# Altium schematic sheet H_BRIDGE.SchDoc
size A
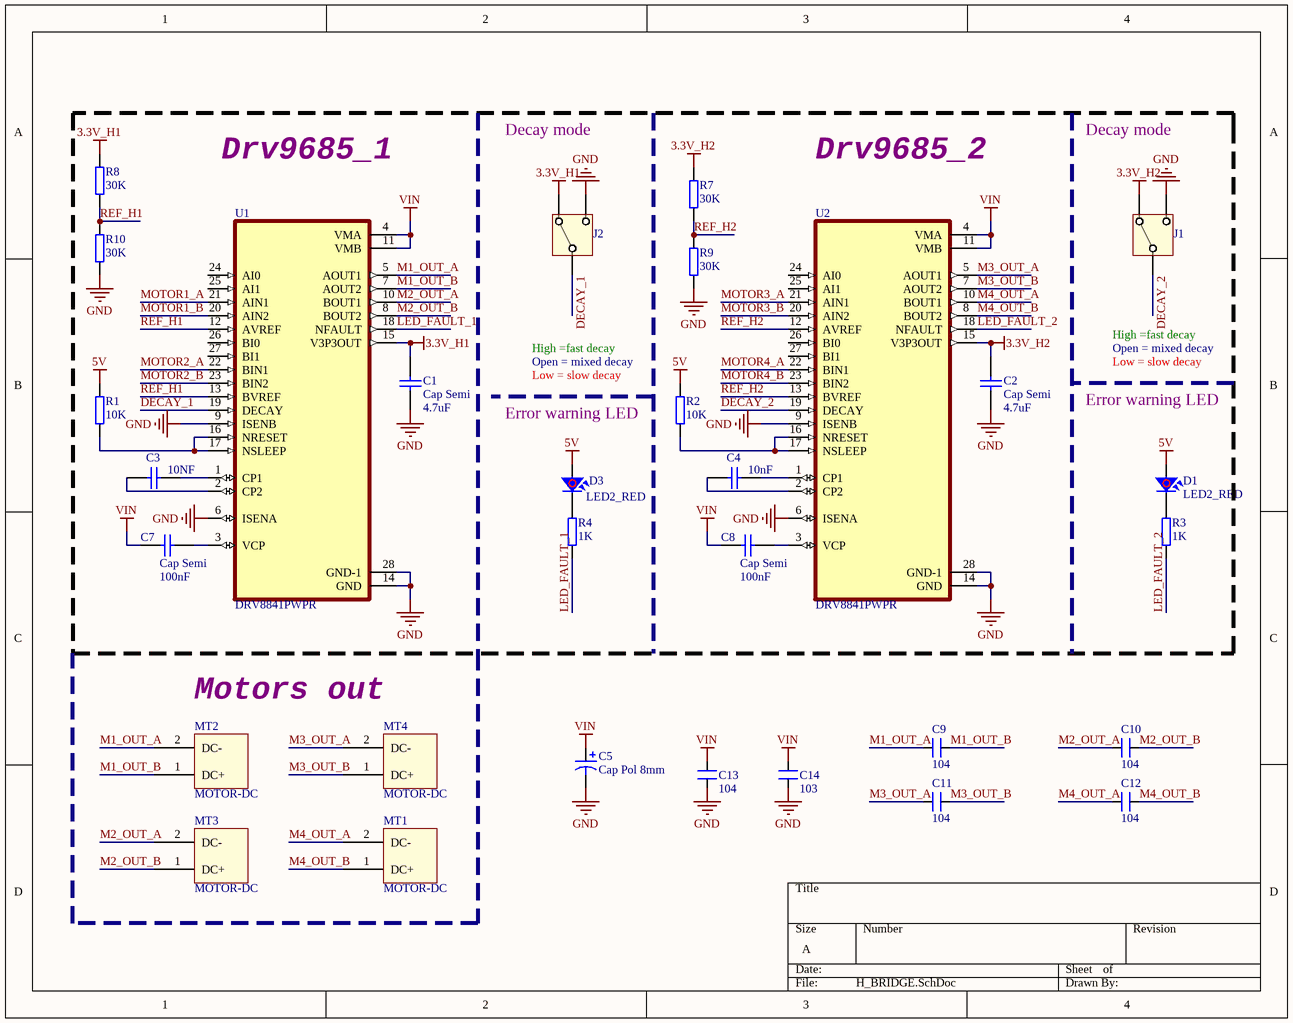
[diagram p0: H_BRIDGE.SchDoc]

## Parts
C1  Cap Semi  value 4.7uF  [SMT0603]
C2  Cap Semi  value 4.7uF  [SMT0603]
C3  value 10NF  [SMT0603]  (hidden comment: Cap Semi)
C4  value 10nF  [SMT0603]  (hidden comment: Cap Semi)
C5  Cap Pol 8mm  [C10mm]
C7  Cap Semi  value 100nF  [SMT0603]
C8  Cap Semi  value 100nF  [SMT0603]
C9  104  [SM-0805]
C10  104  [SM-0805]
C11  104  [SM-0805]
C12  104  [SM-0805]
C13  104  [SM-0805]
C14  103  [SM-0805]
D1  LED2_RED  [LED_RED_SMD0603]
D3  LED2_RED  [LED_RED_SMD0603]
J1  JUMPER-SOLDER-3WAY-BOTTOM  [JUMPER-SOLDER-3WAY-BOTTOM]  (value not drawn)
J2  JUMPER-SOLDER-3WAY-BOTTOM  [JUMPER-SOLDER-3WAY-BOTTOM]  (value not drawn)
MT1  MOTOR-DC  [CON2-5.08DC]
MT2  MOTOR-DC  [CON2-5.08DC]
MT3  MOTOR-DC  [CON2-5.08DC]
MT4  MOTOR-DC  [CON2-5.08DC]
R1  value 10K  [SMT0603]  (hidden comment: Resistor)
R2  value 10K  [SMT0603]  (hidden comment: Resistor)
R3  value 1K  [SMT0603]  (hidden comment: Resistor)
R4  value 1K  [SMT0603]  (hidden comment: Resistor)
R7  value 30K  [SMT0603]  (hidden comment: Resistor)
R8  value 30K  [SMT0603]  (hidden comment: Resistor)
R9  value 30K  [SMT0603]  (hidden comment: Resistor)
R10  value 30K  [SMT0603]  (hidden comment: Resistor)
U1  DRV8841PWPR  [IC_TPS61196PWPRQ1]
U2  DRV8841PWPR  [IC_TPS61196PWPRQ1]

## Nets
3.3V_H1: C1.2 J2.0 R8.2 U1.15(V3P3OUT)
3.3V_H2: C2.2 J1.0 R7.2 U2.15(V3P3OUT)
5V: D1.1 D3.1 R1.2 R2.2
GND: C1.1 C2.1 C5.2 C13.1 C14.1 J1.2 J2.2 R9.1 R10.1 U1.6(ISENA) U1.9(ISENB) U1.14(GND) U1.28(GND-1) U2.6(ISENA) U2.9(ISENB) U2.14(GND) U2.28(GND-1)
VIN: C5.1 C7.1 C8.1 C13.2 C14.2 U1.4(VMA) U1.11(VMB) U2.4(VMA) U2.11(VMB)
DECAY_1: J2.1 U1.19(DECAY)
DECAY_2: J1.1 U2.19(DECAY)
LED_FAULT_1: R4.1 U1.18(NFAULT)
LED_FAULT_2: R3.1 U2.18(NFAULT)
M1_OUT_A: C9.2 MT2.2(DC-) U1.5(AOUT1)
M1_OUT_B: C9.1 MT2.1(DC+) U1.7(AOUT2)
M2_OUT_A: C10.2 MT3.2(DC-) U1.10(BOUT1)
M2_OUT_B: C10.1 MT3.1(DC+) U1.8(BOUT2)
M3_OUT_A: C11.2 MT4.2(DC-) U2.5(AOUT1)
M3_OUT_B: C11.1 MT4.1(DC+) U2.7(AOUT2)
M4_OUT_A: C12.2 MT1.2(DC-) U2.10(BOUT1)
M4_OUT_B: C12.1 MT1.1(DC+) U2.8(BOUT2)
MOTOR1_A: U1.21(AIN1)
MOTOR1_B: U1.20(AIN2)
MOTOR2_A: U1.22(BIN1)
MOTOR2_B: U1.23(BIN2)
MOTOR3_A: U2.21(AIN1)
MOTOR3_B: U2.20(AIN2)
MOTOR4_A: U2.22(BIN1)
MOTOR4_B: U2.23(BIN2)
REF_H1: R8.1 R10.2 U1.12(AVREF) U1.13(BVREF)
REF_H2: R7.1 R9.2 U2.12(AVREF) U2.13(BVREF)
NetC3_1: C3.1 U1.2(CP2)
NetC3_2: C3.2 U1.1(CP1)
NetC4_1: C4.1 U2.2(CP2)
NetC4_2: C4.2 U2.1(CP1)
NetC7_2: C7.2 U1.3(VCP)
NetC8_2: C8.2 U2.3(VCP)
NetD1_2: D1.2 R3.2
NetD3_2: D3.2 R4.2
NetR1_1: R1.1 U1.16(NRESET) U1.17(NSLEEP)
NetR2_1: R2.1 U2.16(NRESET) U2.17(NSLEEP)

Not connected (* = marked no-connect by the designer): U1 24(AI0) 25(AI1) 26(BI0) 27(BI1); U2 24(AI0) 25(AI1) 26(BI0) 27(BI1)

## Notes on the sheet
- Drv9685_1
- Decay mode
- Drv9685_2
- High =fast decay
- (near R2) Open = mixed decay
- Open = mixed decay
- Low = slow decay
- (near R2) Error warning LED
- (near R2) Low = slow decay
- Error warning LED
- Motors out

## Library data of the parts
C1 C2 = CAP-SM-0603-X5R-4.7uF: CAP SM 0603 X5R 4.7uF 10%; Tolerance: ±10%; Supplier 1: Digi-Key; Supplier 2: Farnell; Supplier Part Number 1: 490-3297-1-ND; Supplier Part Number 2: 1907504
C3 C4 = CAP-SM-0603-X5R-10uF: CAP SM 0603 X5R 10uF 10%; Tolerance: ±10%; Supplier 1: Farnell; Supplier 2: Digi-Key; Supplier Part Number 1: 2366833; Supplier Part Number 2: 490-3896-1-ND
C5 = Cap Pol 8mm: Polarized Capacitor (Axial); Published: 8-Jun-2000; LatestRevisionDate: 17-Jul-2002; LatestRevisionNote: Re-released for DXP Platform.; PackageReference: POLAR0.8; Publisher: Altium Limited
C7 C8 = CAP-SM-0603-X7R-100nF: CAP SM 0603 X7R 100nF 10%; Tolerance: ±10%; Supplier 1: Digi-Key; Supplier 2: Farnell; Supplier Part Number 1: 490-3167-1-ND; Supplier Part Number 2: 1775994RL
C9-C13 = CM: Cap SMD; Value: 103
C14 = CM: Cap SMD; Value: 103
D1 D3 = LED2_RED-0603/200mA-2V: LED RED CLEAR 0603 SMD; Manufacturer: Lite-On Inc.; Manufacturer Part Number: LTST-C191KRKT; Lens Color: Colorless; Millicandela Rating: 54mcd; Lens Style/Size: Rectangle with Flat Top, 1.10mm x 0.80mm; Voltage - Forward (Vf) (Typ): 2V; Current - Test: 20mA; Viewing Angle: 130°; Wavelength - Dominant: 631nm; Wavelength - Peak: 639nm; Value: L_RED; /NUM: 6; Supplier 1: Digi-Key; RoHS: RoHS Compliant; Category: Optoelectronics; Stock 1: 680000; Pricing 1: 5000=0.0404, 10000=0.03636, 25000=0.03232, 50000=0.02929, 125000=0.02727 (USD); Packaging: Tape & Reel (TR); Part Status: Active; Color: Red; Lens Transparency: Clear; Mounting Type: Surface Mount; Features: -; Package / Case: 0603 (1608 Metric); Supplier Device Package: *; Size / Dimension: 1.60mm L x 0.80mm W; Height (Max): 0.55mm; ComponentLink1URL: http://optoelectronics.liteon.com/upload/download/DS22-2000-223/S_110_LTST-C191KRKT.pdf; ComponentLink1Description: http://optoelectronics.liteon.com/upload/download/DS22-2000-223/S_110_LTST-C191KRKT.pdf; Supplier Part Number 1: 160-1447-2-ND
R1 R2 R7-R10 = RES-SM-0603-10K: RES SM 0603 10K; Supplier 1: Farnell; Supplier 2: Digi-Key; Supplier Part Number 1: 9330399; Supplier Part Number 2: 541-10.0KHCT-ND
R3 R4 = RES-SM-0603-1K: RES SM 0603 1K
U1 U2 = DRV8841PWPR: Package: None; Price: None; Value: *; MP: DRV8841PWPR; Availability: Unavailable